# Altium project STM32G4_DRV8301_hardware.PrjPcb (part 3 of 5)

## Sheet DRV8301_inverter.SchDoc
size 594 x 420 mm; SheetNumber: 8; SheetTotal: 9
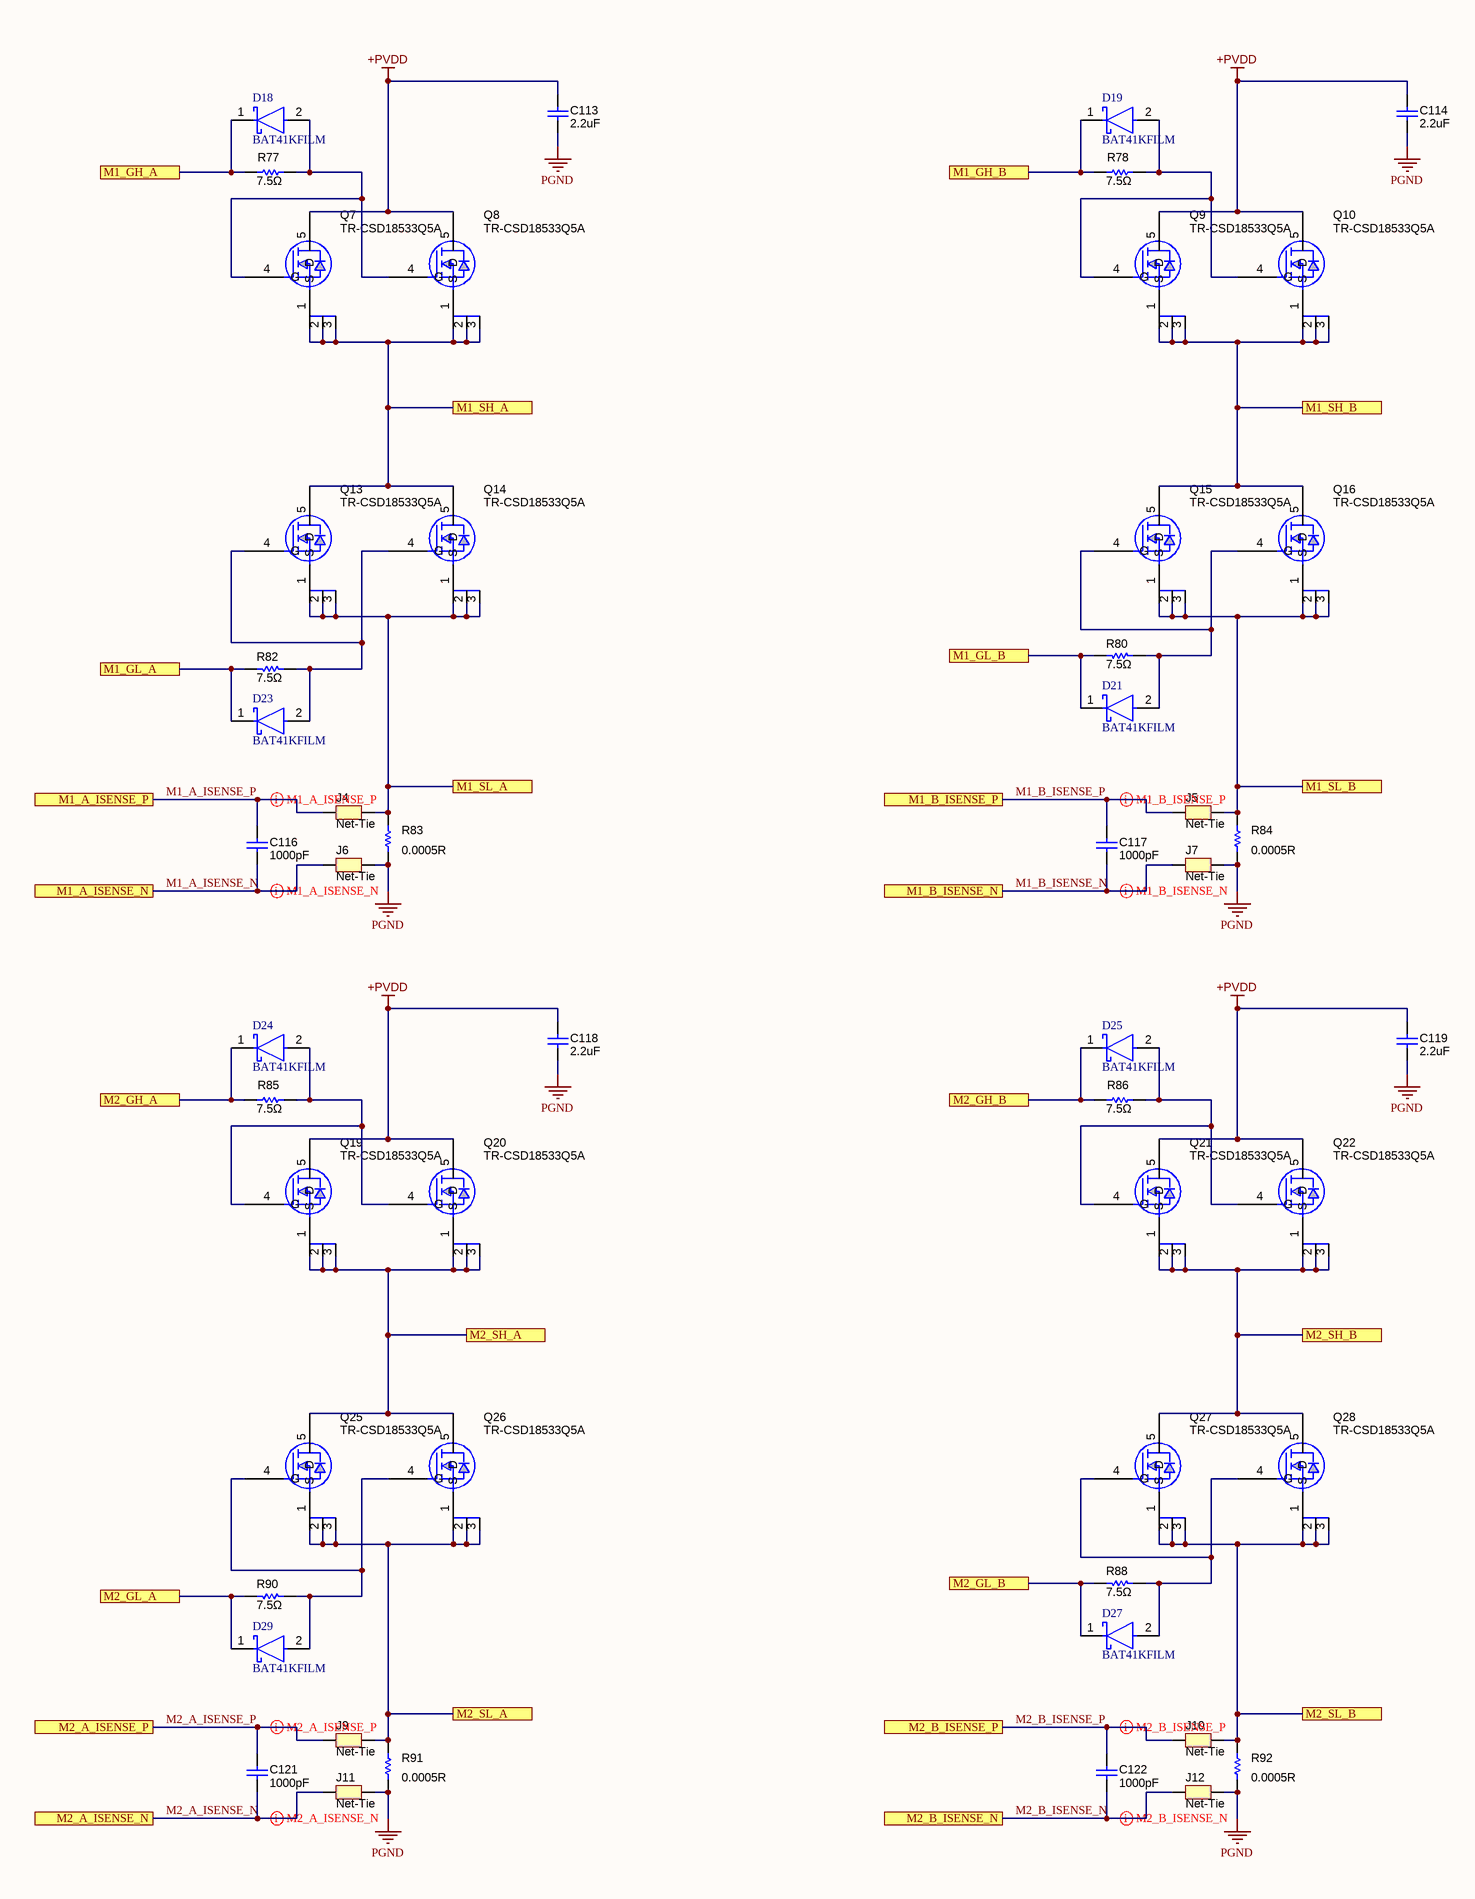
[diagram p6: DRV8301_inverter.SchDoc, left]
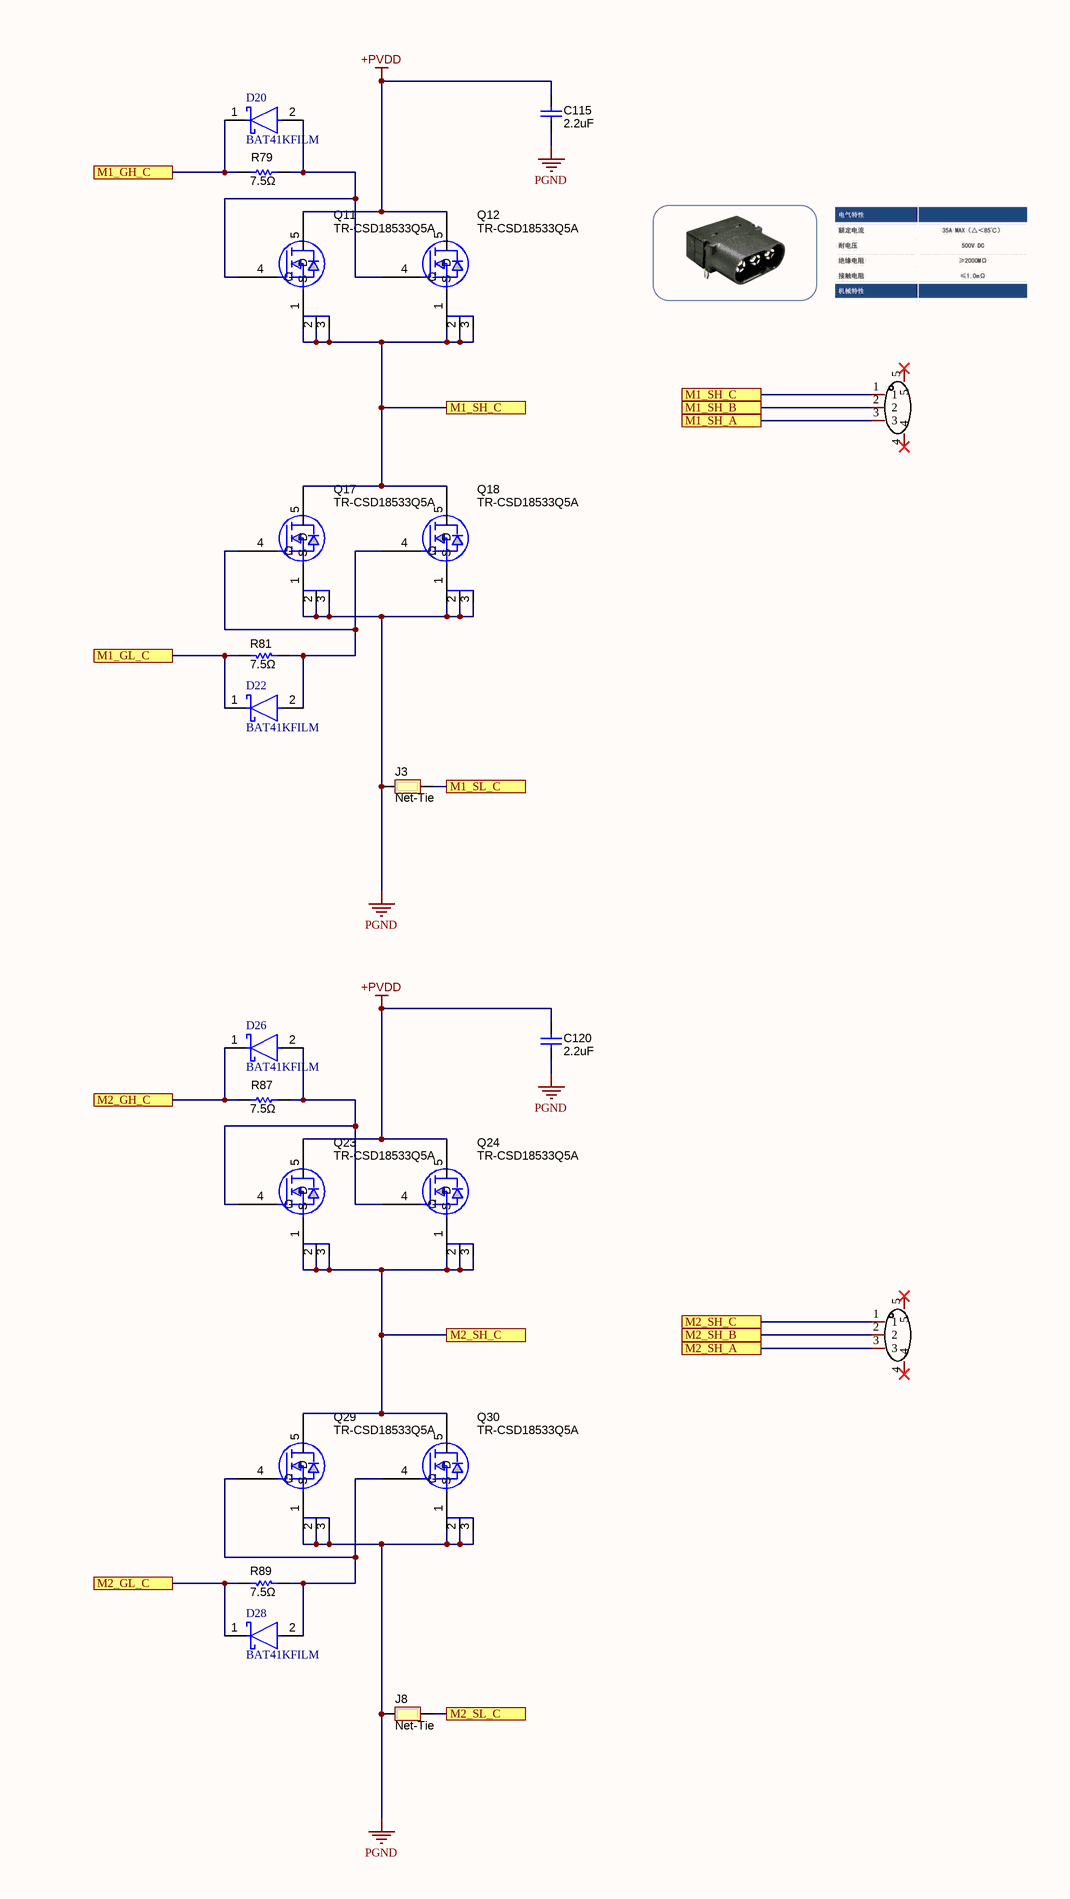
[diagram p7: DRV8301_inverter.SchDoc, right]

### Parts
C113  ValueDisplayed: 2.2uF  [1210L]  (hidden comment: GRM32ER72A225KA35L)
C114  ValueDisplayed: 2.2uF  [1210L]  (hidden comment: GRM32ER72A225KA35L)
C115  ValueDisplayed: 2.2uF  [1210L]  (hidden comment: GRM32ER72A225KA35L)
C116  ValueDisplayed: 1000pF  [0603]  (hidden comment: C0603C102J5GAC)
C117  ValueDisplayed: 1000pF  [0603]  (hidden comment: C0603C102J5GAC)
C118  ValueDisplayed: 2.2uF  [1210L]  (hidden comment: GRM32ER72A225KA35L)
C119  ValueDisplayed: 2.2uF  [1210L]  (hidden comment: GRM32ER72A225KA35L)
C120  ValueDisplayed: 2.2uF  [1210L]  (hidden comment: GRM32ER72A225KA35L)
C121  ValueDisplayed: 1000pF  [0603]  (hidden comment: C0603C102J5GAC)
C122  ValueDisplayed: 1000pF  [0603]  (hidden comment: C0603C102J5GAC)
D18  BAT41KFILM  [FP-SOD-523-MFG]
D19  BAT41KFILM  [FP-SOD-523-MFG]
D20  BAT41KFILM  [FP-SOD-523-MFG]
D21  BAT41KFILM  [FP-SOD-523-MFG]
D22  BAT41KFILM  [FP-SOD-523-MFG]
D23  BAT41KFILM  [FP-SOD-523-MFG]
D24  BAT41KFILM  [FP-SOD-523-MFG]
D25  BAT41KFILM  [FP-SOD-523-MFG]
D26  BAT41KFILM  [FP-SOD-523-MFG]
D27  BAT41KFILM  [FP-SOD-523-MFG]
D28  BAT41KFILM  [FP-SOD-523-MFG]
D29  BAT41KFILM  [FP-SOD-523-MFG]
J3  Net-Tie  [Net-Tie_10mil]  (net tie, no BOM)
J4  Net-Tie  [Net-Tie_10mil]  (net tie, no BOM)
J5  Net-Tie  [Net-Tie_10mil]  (net tie, no BOM)
J6  Net-Tie  [Net-Tie_10mil]  (net tie, no BOM)
J7  Net-Tie  [Net-Tie_10mil]  (net tie, no BOM)
J8  Net-Tie  [Net-Tie_10mil]  (net tie, no BOM)
J9  Net-Tie  [Net-Tie_10mil]  (net tie, no BOM)
J10  Net-Tie  [Net-Tie_10mil]  (net tie, no BOM)
J11  Net-Tie  [Net-Tie_10mil]  (net tie, no BOM)
J12  Net-Tie  [Net-Tie_10mil]  (net tie, no BOM)
Q7  TR-CSD18533Q5A  [QFN5X6MM]
Q8  TR-CSD18533Q5A  [QFN5X6MM]
Q9  TR-CSD18533Q5A  [QFN5X6MM]
Q10  TR-CSD18533Q5A  [QFN5X6MM]
Q11  TR-CSD18533Q5A  [QFN5X6MM]
Q12  TR-CSD18533Q5A  [QFN5X6MM]
Q13  TR-CSD18533Q5A  [QFN5X6MM]
Q14  TR-CSD18533Q5A  [QFN5X6MM]
Q15  TR-CSD18533Q5A  [QFN5X6MM]
Q16  TR-CSD18533Q5A  [QFN5X6MM]
Q17  TR-CSD18533Q5A  [QFN5X6MM]
Q18  TR-CSD18533Q5A  [QFN5X6MM]
Q19  TR-CSD18533Q5A  [QFN5X6MM]
Q20  TR-CSD18533Q5A  [QFN5X6MM]
Q21  TR-CSD18533Q5A  [QFN5X6MM]
Q22  TR-CSD18533Q5A  [QFN5X6MM]
Q23  TR-CSD18533Q5A  [QFN5X6MM]
Q24  TR-CSD18533Q5A  [QFN5X6MM]
Q25  TR-CSD18533Q5A  [QFN5X6MM]
Q26  TR-CSD18533Q5A  [QFN5X6MM]
Q27  TR-CSD18533Q5A  [QFN5X6MM]
Q28  TR-CSD18533Q5A  [QFN5X6MM]
Q29  TR-CSD18533Q5A  [QFN5X6MM]
Q30  TR-CSD18533Q5A  [QFN5X6MM]
R77  value 7.5Ω  [0603L]  (hidden comment: CRCW060310R0JNEA)
R78  value 7.5Ω  [0603L]  (hidden comment: CRCW060310R0JNEA)
R79  value 7.5Ω  [0603L]  (hidden comment: CRCW060310R0JNEA)
R80  value 7.5Ω  [0603L]  (hidden comment: CRCW060310R0JNEA)
R81  value 7.5Ω  [0603L]  (hidden comment: CRCW060310R0JNEA)
R82  value 7.5Ω  [0603L]  (hidden comment: CRCW060310R0JNEA)
R83  value 0.0005R  [2512M]  (hidden comment: CRA2512-FZ-R010ELF)
R84  value 0.0005R  [2512M]  (hidden comment: CRA2512-FZ-R010ELF)
R85  value 7.5Ω  [0603L]  (hidden comment: CRCW060310R0JNEA)
R86  value 7.5Ω  [0603L]  (hidden comment: CRCW060310R0JNEA)
R87  value 7.5Ω  [0603L]  (hidden comment: CRCW060310R0JNEA)
R88  value 7.5Ω  [0603L]  (hidden comment: CRCW060310R0JNEA)
R89  value 7.5Ω  [0603L]  (hidden comment: CRCW060310R0JNEA)
R90  value 7.5Ω  [0603L]  (hidden comment: CRCW060310R0JNEA)
R91  value 0.0005R  [2512M]  (hidden comment: CRA2512-FZ-R010ELF)
R92  value 0.0005R  [2512M]  (hidden comment: CRA2512-FZ-R010ELF)
U25  MR60PW-M.G.B  [CONN-TH_MR60PW]  (value not drawn)
U26  MR60PW-M.G.B  [CONN-TH_MR60PW]  (value not drawn)

### Ports
M1_A_ISENSE_N (see STM32G4_DRV8301_hardware_TOP_V1.0[6D], M1_DRV8301_driver[6D]), M1_A_ISENSE_P (see STM32G4_DRV8301_hardware_TOP_V1.0[6D], M1_DRV8301_driver[6D]), M1_B_ISENSE_N (see STM32G4_DRV8301_hardware_TOP_V1.0[6D], M1_DRV8301_driver[6D]), M1_B_ISENSE_P (see STM32G4_DRV8301_hardware_TOP_V1.0[6D], M1_DRV8301_driver[6D]), M1_GH_A (see STM32G4_DRV8301_hardware_TOP_V1.0[6C], M1_DRV8301_driver[6C]), M1_GH_B (see STM32G4_DRV8301_hardware_TOP_V1.0[6C], M1_DRV8301_driver[6C]), M1_GH_C (see STM32G4_DRV8301_hardware_TOP_V1.0[6C], M1_DRV8301_driver[6D]), M1_GL_A (see STM32G4_DRV8301_hardware_TOP_V1.0[6C], M1_DRV8301_driver[6C]), M1_GL_B (see STM32G4_DRV8301_hardware_TOP_V1.0[6C], M1_DRV8301_driver[6C]), M1_GL_C (see STM32G4_DRV8301_hardware_TOP_V1.0[6D], M1_DRV8301_driver[6D]), M1_SH_A (see STM32G4_DRV8301_hardware_TOP_V1.0[6C], M1_DRV8301_driver[7C]), M1_SH_B (see STM32G4_DRV8301_hardware_TOP_V1.0[6C], M1_DRV8301_driver[7C]), M1_SH_C (see STM32G4_DRV8301_hardware_TOP_V1.0[6D], M1_DRV8301_driver[7D]), M1_SL_A (see STM32G4_DRV8301_hardware_TOP_V1.0[6C], M1_DRV8301_driver[6C]), M1_SL_B (see STM32G4_DRV8301_hardware_TOP_V1.0[6C], M1_DRV8301_driver[6C]), M1_SL_C (see STM32G4_DRV8301_hardware_TOP_V1.0[6D], M1_DRV8301_driver[6D]), M2_A_ISENSE_N (see STM32G4_DRV8301_hardware_TOP_V1.0[6C], M2_DRV8301_driver[7D]), M2_A_ISENSE_P (see STM32G4_DRV8301_hardware_TOP_V1.0[6C], M2_DRV8301_driver[7D]), M2_B_ISENSE_N (see STM32G4_DRV8301_hardware_TOP_V1.0[6C], M2_DRV8301_driver[7D]), M2_B_ISENSE_P (see STM32G4_DRV8301_hardware_TOP_V1.0[6C], M2_DRV8301_driver[7D]), M2_GH_A (see STM32G4_DRV8301_hardware_TOP_V1.0[6B], M2_DRV8301_driver[6C]), M2_GH_B (see STM32G4_DRV8301_hardware_TOP_V1.0[6B], M2_DRV8301_driver[6C]), M2_GH_C (see STM32G4_DRV8301_hardware_TOP_V1.0[6C], M2_DRV8301_driver[6D]), M2_GL_A (see STM32G4_DRV8301_hardware_TOP_V1.0[6B], M2_DRV8301_driver[6C]), M2_GL_B (see STM32G4_DRV8301_hardware_TOP_V1.0[6B], M2_DRV8301_driver[6C]), M2_GL_C (see STM32G4_DRV8301_hardware_TOP_V1.0[6C], M2_DRV8301_driver[6D]), M2_SH_A (see STM32G4_DRV8301_hardware_TOP_V1.0[6B], M2_DRV8301_driver[7C]), M2_SH_B (see STM32G4_DRV8301_hardware_TOP_V1.0[6B], M2_DRV8301_driver[7C]), M2_SH_C (see STM32G4_DRV8301_hardware_TOP_V1.0[6C], M2_DRV8301_driver[7D]), M2_SL_A (see STM32G4_DRV8301_hardware_TOP_V1.0[6B], M2_DRV8301_driver[6C]), M2_SL_B (see STM32G4_DRV8301_hardware_TOP_V1.0[6B], M2_DRV8301_driver[6C]), M2_SL_C (see STM32G4_DRV8301_hardware_TOP_V1.0[6C], M2_DRV8301_driver[6D])

### Nets
+PVDD: C113.1 C114.1 C115.1 C118.1 C119.1 C120.1 Q7.5(D) Q8.5(D) Q9.5(D) Q10.5(D) Q11.5(D) Q12.5(D) Q19.5(D) Q20.5(D) Q21.5(D) Q22.5(D) Q23.5(D) Q24.5(D)
PGND: C113.2 C114.2 C115.2 C118.2 C119.2 C120.2 J3.2 J6.1 J7.1 J8.2 J11.1 J12.1 Q17.1(S) Q17.2 Q17.3 Q18.1(S) Q18.2 Q18.3 Q29.1(S) Q29.2 Q29.3 Q30.1(S) Q30.2 Q30.3 R83.1 R84.1 R91.1 R92.1
M1_A_ISENSE_N: C116.2 J6.2 ; port M1_A_ISENSE_N
M1_A_ISENSE_P: C116.1 J4.2 ; port M1_A_ISENSE_P
M1_B_ISENSE_N: C117.2 J7.2 ; port M1_B_ISENSE_N
M1_B_ISENSE_P: C117.1 J5.2 ; port M1_B_ISENSE_P
M1_GH_A: D18.1(C) R77.1 ; port M1_GH_A
M1_GH_B: D19.1(C) R78.1 ; port M1_GH_B
M1_GH_C: D20.1(C) R79.1 ; port M1_GH_C
M1_GL_A: D23.1(C) R82.1 ; port M1_GL_A
M1_GL_B: D21.1(C) R80.1 ; port M1_GL_B
M1_GL_C: D22.1(C) R81.1 ; port M1_GL_C
M1_SH_A: Q7.1(S) Q7.2 Q7.3 Q8.1(S) Q8.2 Q8.3 Q13.5(D) Q14.5(D) U25.3 ; port M1_SH_A
M1_SH_B: Q9.1(S) Q9.2 Q9.3 Q10.1(S) Q10.2 Q10.3 Q15.5(D) Q16.5(D) U25.2 ; port M1_SH_B
M1_SH_C: Q11.1(S) Q11.2 Q11.3 Q12.1(S) Q12.2 Q12.3 Q17.5(D) Q18.5(D) U25.1 ; port M1_SH_C
M1_SL_A: J4.1 Q13.1(S) Q13.2 Q13.3 Q14.1(S) Q14.2 Q14.3 R83.2 ; port M1_SL_A
M1_SL_B: J5.1 Q15.1(S) Q15.2 Q15.3 Q16.1(S) Q16.2 Q16.3 R84.2 ; port M1_SL_B
M1_SL_C: J3.1 ; port M1_SL_C
M2_A_ISENSE_N: C121.2 J11.2 ; port M2_A_ISENSE_N
M2_A_ISENSE_P: C121.1 J9.2 ; port M2_A_ISENSE_P
M2_B_ISENSE_N: C122.2 J12.2 ; port M2_B_ISENSE_N
M2_B_ISENSE_P: C122.1 J10.2 ; port M2_B_ISENSE_P
M2_GH_A: D24.1(C) R85.1 ; port M2_GH_A
M2_GH_B: D25.1(C) R86.1 ; port M2_GH_B
M2_GH_C: D26.1(C) R87.1 ; port M2_GH_C
M2_GL_A: D29.1(C) R90.1 ; port M2_GL_A
M2_GL_B: D27.1(C) R88.1 ; port M2_GL_B
M2_GL_C: D28.1(C) R89.1 ; port M2_GL_C
M2_SH_A: Q19.1(S) Q19.2 Q19.3 Q20.1(S) Q20.2 Q20.3 Q25.5(D) Q26.5(D) U26.3 ; port M2_SH_A
M2_SH_B: Q21.1(S) Q21.2 Q21.3 Q22.1(S) Q22.2 Q22.3 Q27.5(D) Q28.5(D) U26.2 ; port M2_SH_B
M2_SH_C: Q23.1(S) Q23.2 Q23.3 Q24.1(S) Q24.2 Q24.3 Q29.5(D) Q30.5(D) U26.1 ; port M2_SH_C
M2_SL_A: J9.1 Q25.1(S) Q25.2 Q25.3 Q26.1(S) Q26.2 Q26.3 R91.2 ; port M2_SL_A
M2_SL_B: J10.1 Q27.1(S) Q27.2 Q27.3 Q28.1(S) Q28.2 Q28.3 R92.2 ; port M2_SL_B
M2_SL_C: J8.1 ; port M2_SL_C
NetD18_2: D18.2(A) Q7.4(G) Q8.4(G) R77.2
NetD19_2: D19.2(A) Q9.4(G) Q10.4(G) R78.2
NetD20_2: D20.2(A) Q11.4(G) Q12.4(G) R79.2
NetD21_2: D21.2(A) Q15.4(G) Q16.4(G) R80.2
NetD22_2: D22.2(A) Q17.4(G) Q18.4(G) R81.2
NetD23_2: D23.2(A) Q13.4(G) Q14.4(G) R82.2
NetD24_2: D24.2(A) Q19.4(G) Q20.4(G) R85.2
NetD25_2: D25.2(A) Q21.4(G) Q22.4(G) R86.2
NetD26_2: D26.2(A) Q23.4(G) Q24.4(G) R87.2
NetD27_2: D27.2(A) Q27.4(G) Q28.4(G) R88.2
NetD28_2: D28.2(A) Q29.4(G) Q30.4(G) R89.2
NetD29_2: D29.2(A) Q25.4(G) Q26.4(G) R90.2

Not connected (* = marked no-connect by the designer): U25 4* 5*; U26 4* 5*

### Layout directives
differential pair: M1_A_ISENSE_N, M1_A_ISENSE_P, M1_B_ISENSE_N, M1_B_ISENSE_P, M2_A_ISENSE_N, M2_A_ISENSE_P, M2_B_ISENSE_N, M2_B_ISENSE_P

### Notes on the sheet
- DWG NO:
- REV:
- THIS DOCUMENT AND THE DATA DISCLOSED HEREIN OR
- HEREWITH IS THE PROPERTY OF ALTIUM LIMITED AND MAY
- BE FREELY DISTRIBUTED IN WHOLE. NO RIGHTS ARE
- RESERVED OR EXPRESS OR IMPLIED WARANTEE GIVEN.
- REVISION
- DESCRIPTION
- DATE
- APPROVED
- ENG:
- APPROVALS
- PROJECT
- DSN:
- CHK:
- REFERENCE DOCUMENTS
- PROJECT REVISION:
- TITLE
- DOCUMENT REVISION:
- DESIGN ITEM:
- BOM:
- FAB DWG:
- PCB DWG:
- ASSY DWG:
- SCALE:
- A2
- SIZE
- CAGE CODE
- FILE NAME
- DWG NO.
- SHEET
- OF
- REV

### Library data of the parts
C113-C115 C118-C120 = GRM32ER72A225KA35L: CAP, CERM, 2.2uF, 100V, +/-10%, X7R, 1210; Manufacturer: MuRata; Polarized: N; CompType: Capacitor; U/M: EA; Cap_F: 0.0000022; Tolerance_%: 10; ESR_Ohm: 0.007; Value1: 0.007 ohm; VDC_V: 100; IRMS_A: 4.4; TaMin_C: -55; TaMax_C: 125; Cap_Case: 1210; SymbolVersion: 2008-07-09; Value: 2.2uF; PartNumber: GRM32ER72A225KA35L; PackageReference: 1210; RoHS: Y; Value2: 100V; MountType: SMT; Technology: Ceramic; TempCo: X7R; Published: 2008-06-19; Publisher: Texas Instruments; LatestRevisionDate: 2013-05-24; LatestRevisionNote: Changed publisher; ComponentLink1Description: Datasheet link; ComponentLink1URL: http://search.murata.co.jp/Ceramy/PnsearchViewAction.do?HnOFG=ON&HnNFG=ON&SEL_CNT=50&sLang=en&sKey=GRM32ER72A225KA35L&x=9&y=9&search=startwith; Supplier 1: Digi-Key; Supplier Part Number 1: 490-3385-1-ND; Supplier 2: Mouser; Supplier Part Number 2: 81-GRM32ER72A225KA35; Supplier 3: Farnell; Supplier Part Number 3: 1735547
C116 C117 C121 C122 = C0603C102J5GAC: CAP, CERM, 1000pF, 50V, +/-5%, C0G/NP0, 0603; Manufacturer: Kemet; Polarized: N; CompType: Capacitor; U/M: EA; Cap_F: 0.000000001; Tolerance_%: 5; Value1: Unknown; VDC_V: 50; TaMin_C: -55; TaMax_C: 125; SymbolVersion: 2008-07-09; Value: 1000pF; PartNumber: C0603C102J5GAC; PackageReference: 0603; RoHS: Y; Value2: 50V; MountType: SMT; Technology: Ceramic; TempCo: C0G/NP0; Cap_Case: 0603; Published: 2008-06-19; Publisher: Texas Instruments; LatestRevisionDate: 2013-05-24; LatestRevisionNote: Changed publisher; ComponentLink1Description: Datasheet link; ComponentLink1URL: http://www.kemet.com/kemet/web/homepage/kechome.nsf/vapubfiles/F3102_Y5V.pdf/$file/F3102_Y5V.pdf; Supplier 1: Farnell; Supplier Part Number 1: 317202
D18-D29 = CMP-12187-000015-1: DIODE SCHOTTKY 100V 200MA SOD523; Manufacturer: STMicroelectronics; Max Junction Temp: +150°C; Max Surge Forward Current: 1A; Capacitance: 3pF; Peak Reverse Current: 0.1uA; Value: 3pF; Automotive: No; Max Repetitive Reverse Voltage: 100V; Octopart: https://octopart.com/bat41kfilm-stmicroelectronics-658186; Temperature Range High: +150°C; Digikey Description: DIODE SCHOTTKY 100V 200MA SOD523; Device Class L2: Diodes; Forward Current: 200mA; Device Class L1: Discrete Semiconductors; Lead Free: Yes; Temperature: to +150°C; Manufacturer Part Number: BAT41KFILM; Mouser Description: Schottky Diodes & Rectifiers schottky diode; Height: 0.7mm; RoHS: TRUE; ComponentLink2Description: Datasheet; Device Class L3: Schottky Diodes; Category: Diode; Package: SOD-523; ComponentLink2URL: https://www.st.com/resource/en/datasheet/bat41.pdf
J3-J12 = Net-Tie: Single point connection between nets.; SymbolCreator: codlsc; SymbolVersion: 2009-07-01; MountType: SMT; Publisher: Texas Instruments; LatestRevisionDate: 2013-05-15; LatestRevisionNote: Added Alternate PartNumber and Alternate Manufacturer parameters to appropriate components.
Q7-Q30 = TR-CSD18533Q5A: MOSFET, N-Chan, 60V, 18A, 6.1 mOhm; Manufacturer: TI; Area: 86800; SymbolVersion: 04/25/2012 11:24:36; PartNumber: CSD18533Q5A; ComponentLink1URL: \\vette02\pmp_pcb\pcad_pdf's\CSD18533Q5A.pdf; PackageReference: QFN-8 POWER; Value: CSD18533Q5A; ComponentHeight: *; ComponentLink1Description: AEO Datasheet Link
R77-R82 R85-R90 = CRCW060310R0JNEA: RES, 7.5 ohm, 5%, 0.1W, 0603; Manufacturer: Vishay-Dale; CompType: Resistor; Res_ohm: 10; Value_Code: 10R0; Tolerance_%: 5; Power_W: 0.1; VDC_V: 75; TempCo: 200 ppm/C; EIA_Code: E24; U/M: EA; SymbolVersion: 2009-05-29; PartNumber: CRCW060310R0JNEA; PackageReference: 0603; RoHS: Y; Value1: 5%; Value2: 0.1W; MountType: SMT; Technology: Thick Film; Published: 2008-06-26; Publisher: Texas Instruments; LatestRevisionDate: 2013-01-08; ComponentLink1Description: Datasheet link; ComponentLink1URL: http://www.vishay.com/docs/20035/dcrcwe3.pdf; Supplier 1: Digi-Key; Supplier Part Number 1: 541-10GCT-ND; Supplier 2: Mouser; Supplier Part Number 2: 71-CRCW0603J-10-E3; Supplier 3: Farnell; Supplier Part Number 3: 1514712
R83 R84 R91 R92 = CRA2512-FZ-R010ELF: RES, 0.01 ohm, 1%, 3W, 2512; Manufacturer: Bourns; CompType: Resistor; Res_ohm: 0.01; Value_Code: R010; Tolerance_%: 1; Power_W: 3; TempCo: 75 ppm/C; EIA_Code: E96; U/M: EA; SymbolVersion: 2009-05-29; PartNumber: CRA2512-FZ-R010ELF; PackageReference: 2512; RoHS: Y; Value1: 1%; Value2: 3W; MountType: SMT; Technology: Metal Film; Published: 2008-06-26; Publisher: Texas Instruments; LatestRevisionDate: 2013-05-25; ComponentLink1Description: Datasheet link; ComponentLink1URL: http://www.bourns.com/data/global/pdfs/CRA.pdf; Supplier 1: Digi-Key; Supplier Part Number 1: CRA2512-FZ-R010ELFCT-ND; Supplier 2: Mouser; Supplier Part Number 2: 652-CRA2512FZR010ELF; Supplier 3: Farnell; Supplier Part Number 3: 1435947
U25 U26 = MR60PW-M.G.B: Manufacturer: AMASS(艾迈斯); Add into BOM: yes; Symbol: MR60PW-M.G.B; Device: MR60PW-M.G.B; LCSC Part Name: MR60PW 20A三芯PCB弯插公镀金黑色; Supplier Part: C19268044; Manufacturer Part: MR60PW-M.G.B; Supplier Footprint: -; JLCPCB Part Class: Extended Part; Datasheet: https://atta.szlcsc.com/upload/public/pdf/source/20231221/53B4DC893AF29571B873350396E957CB.pdf; Supplier: LCSC; Convert to PCB: yes

## Sheet STM32F1_microcontroller.SchDoc
size 420 x 297 mm; SheetNumber: 9; SheetTotal: 9
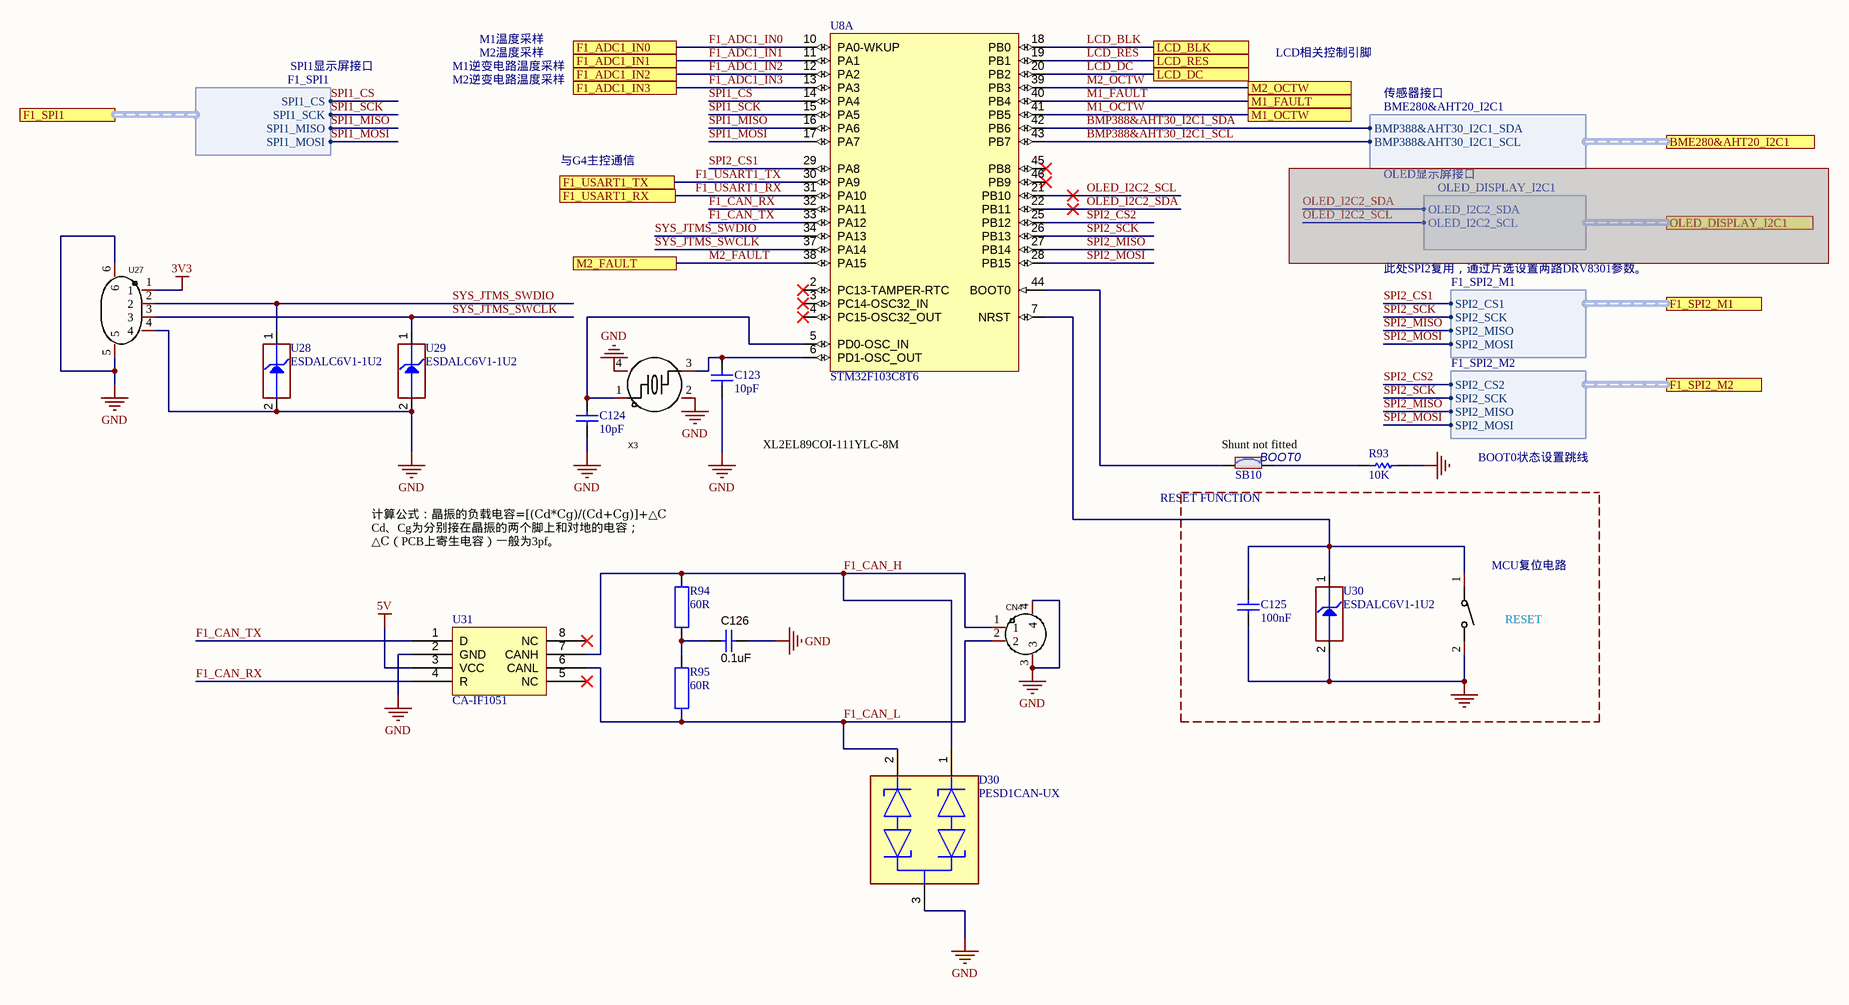
[diagram p8: STM32F1_microcontroller.SchDoc]

### Parts
C123  value 10pF  [C0402]
C124  value 10pF  [C0402]
C125  value 100nF  [C0402]
C126  ValueDisplayed: 0.1uF  [0603L]  (hidden comment: GRM188R61E105KA12D)
CN4  WAFER-GH1.25-2PWB  [CONN-TH_2P-P1.25_XUNPU_WAFER-GH1.25-2PWB]  (value not drawn)
D30  PESD1CAN-UX  [FP-SOT323-MFG]
R93  value 10K  [R0603]
R94  60R  [RESC1608X55N]
R95  60R  [RESC1608X55N]
SB10  MCD-00071  [SOLDER-BRIDGE_R0603-0R]  (value not drawn)
SW2  TS-1088-AR02016  [SW-SMD_L3.9-W3.0-P4.45]  (value not drawn)
U8  STM32F103C8T6  [STM-LQFP48_L]  (part A of 2)
U27  WAFER-GH1.25-4PWB  [CONN-SMD_4P-P1.25_XUNPU_WAFER-GH1.25-4PWB]  (value not drawn)
U28  value ESDALC6V1-1U2  [ESD_ST0201]
U29  value ESDALC6V1-1U2  [ESD_ST0201]
U30  value ESDALC6V1-1U2  [ESD_ST0201]
U31  CA-IF1051  [SOIC127P600X175-8N]
X3  8MHz  [CRYSTAL-SMD_4P-L3.2-W2.5-BL-1]  (value not drawn)

### Ports
BME280&AHT20_I2C1 (harness BME280&AHT20_I2C1, see STM32G4_DRV8301_hardware_TOP_V1.0[3B], DRV8301_SENSE[3D]), F1_ADC1_IN0 (see STM32G4_DRV8301_hardware_TOP_V1.0[2B]), F1_ADC1_IN1 (see STM32G4_DRV8301_hardware_TOP_V1.0[2B]), F1_ADC1_IN2 (see STM32G4_DRV8301_hardware_TOP_V1.0[2B]), F1_ADC1_IN3 (see STM32G4_DRV8301_hardware_TOP_V1.0[2B]), F1_SPI1 (harness F1_SPI1, see STM32G4_DRV8301_hardware_TOP_V1.0[3B], DRV8301_SENSE[4D]), F1_SPI2_M1 (harness F1_SPI2_M1, see STM32G4_DRV8301_hardware_TOP_V1.0[3B], M1_DRV8301_driver[3C]), F1_SPI2_M2 (harness F1_SPI2_M2, see STM32G4_DRV8301_hardware_TOP_V1.0[3B], M2_DRV8301_driver[3C]), F1_USART1_RX (see STM32G4_DRV8301_hardware_TOP_V1.0[2B]), F1_USART1_TX (see STM32G4_DRV8301_hardware_TOP_V1.0[2B]), LCD_BLK (see STM32G4_DRV8301_hardware_TOP_V1.0[3B]), LCD_DC (see STM32G4_DRV8301_hardware_TOP_V1.0[3B]), LCD_RES (see STM32G4_DRV8301_hardware_TOP_V1.0[3B]), M1_FAULT (see STM32G4_DRV8301_hardware_TOP_V1.0[2B]), M1_OCTW (see STM32G4_DRV8301_hardware_TOP_V1.0[2B]), M2_FAULT (see STM32G4_DRV8301_hardware_TOP_V1.0[2B]), M2_OCTW (see STM32G4_DRV8301_hardware_TOP_V1.0[2B]), OLED_DISPLAY_I2C1 (harness OLED_DISPLAY_I2C1, see STM32G4_DRV8301_hardware_TOP_V1.0[3B])

### Harnesses
F1_SPI1: SPI1_CS, SPI1_SCK, SPI1_MISO, SPI1_MOSI
BME280&AHT20_I2C1: BMP388&AHT30_I2C1_SDA, BMP388&AHT30_I2C1_SCL
OLED_DISPLAY_I2C1: OLED_I2C2_SDA, OLED_I2C2_SCL
F1_SPI2_M1: SPI2_CS1, SPI2_SCK, SPI2_MISO, SPI2_MOSI
F1_SPI2_M2: SPI2_SCK, SPI2_MISO, SPI2_MOSI, SPI2_CS2

### Nets
3V3: U27.1
5V: U31.3(VCC)
GND: C123.2 C124.2 C125.1 C126.2 CN4.3 CN4.4 D30.3(common_cathode) R93.1 SW2.2 U27.4 U27.5 U27.6 U28.2(GND) U29.2(GND) U30.2(GND) U31.2(GND) X3.2(GND) X3.4(GND)
BMP388&AHT30_I2C1_SCL: U8.43(PB7) ; port BME280&AHT20_I2C1.BMP388&AHT30_I2C1_SCL
BMP388&AHT30_I2C1_SDA: U8.42(PB6) ; port BME280&AHT20_I2C1.BMP388&AHT30_I2C1_SDA
F1_ADC1_IN0: U8.10(PA0-WKUP) ; port F1_ADC1_IN0
F1_ADC1_IN1: U8.11(PA1) ; port F1_ADC1_IN1
F1_ADC1_IN2: U8.12(PA2) ; port F1_ADC1_IN2
F1_ADC1_IN3: U8.13(PA3) ; port F1_ADC1_IN3
F1_CAN_H: CN4.1 D30.1(cathode_1) R94.2 U31.7(CANH)
F1_CAN_L: CN4.2 D30.2(cathode_2) R95.1 U31.6(CANL)
F1_CAN_RX: U8.32(PA11) U31.4(R)
F1_CAN_TX: U8.33(PA12) U31.1(D)
F1_USART1_RX: U8.31(PA10) ; port F1_USART1_RX
F1_USART1_TX: U8.30(PA9) ; port F1_USART1_TX
LCD_BLK: U8.18(PB0) ; port LCD_BLK
LCD_DC: U8.20(PB2) ; port LCD_DC
LCD_RES: U8.19(PB1) ; port LCD_RES
M1_FAULT: U8.40(PB4) ; port M1_FAULT
M1_OCTW: U8.41(PB5) ; port M1_OCTW
M2_FAULT: U8.38(PA15) ; port M2_FAULT
M2_OCTW: U8.39(PB3) ; port M2_OCTW
OLED_I2C2_SCL: U8.21(PB10)
OLED_I2C2_SDA: U8.22(PB11)
SPI1_CS: U8.14(PA4) ; port F1_SPI1.SPI1_CS
SPI1_MISO: U8.16(PA6) ; port F1_SPI1.SPI1_MISO
SPI1_MOSI: U8.17(PA7) ; port F1_SPI1.SPI1_MOSI
SPI1_SCK: U8.15(PA5) ; port F1_SPI1.SPI1_SCK
SPI2_CS1: U8.29(PA8) ; port F1_SPI2_M1.SPI2_CS1  [project net M1_M_PWM/~{SCS}]
SPI2_CS2: U8.25(PB12) ; port F1_SPI2_M2.SPI2_CS2  [project net M2_M_PWM/~{SCS}]
SPI2_MISO: U8.27(PB14) ; port F1_SPI2_M1.SPI2_MISO, port F1_SPI2_M2.SPI2_MISO  [project net M1_GAIN/~{SDO}]
SPI2_MOSI: U8.28(PB15) ; port F1_SPI2_M1.SPI2_MOSI, port F1_SPI2_M2.SPI2_MOSI  [project net M1_M_OC/~{SDI}]
SPI2_SCK: U8.26(PB13) ; port F1_SPI2_M1.SPI2_SCK, port F1_SPI2_M2.SPI2_SCK  [project net M1_OC_ADJ/~{SCLK}]
SYS_JTMS_SWCLK: U8.37(PA14) U27.3 U29.1(IO1)
SYS_JTMS_SWDIO: U8.34(PA13) U27.2 U28.1(IO1)
NetC123_1: C123.1 U8.6(PD1-OSC_OUT) X3.3
NetC124_1: C124.1 U8.5(PD0-OSC_IN) X3.1
NetC125_2: C125.2 SW2.1 U8.7(NRST) U30.1(IO1)
NetC126_1: C126.1 R94.1 R95.2
NetR93_2: R93.2 SB10.2
NetSB10_1: SB10.1 U8.44(BOOT0)

Not connected (* = marked no-connect by the designer): U8 2(PC13-TAMPER-RTC)* 3(PC14-OSC32_IN)* 4(PC15-OSC32_OUT)* 45(PB8)* 46(PB9)*; U31 5(NC)* 8(NC)*

### Notes on the sheet
- SPI1显示屏接口
- M1逆变电路温度采样
- M2逆变电路温度采样
- M1温度采样
- M2温度采样
- LCD相关控制引脚
- 传感器接口
- 与G4主控通信
- OLED显示屏接口
- 此处SPI2复用，通过片选设置两路DRV8301参数。
- XL2EL89COI-111YLC-8M
- (near SB10) Shunt not fitted
- BOOT0
- BOOT0状态设置跳线
- (near R94) 计算公式：晶振的负载电容=[(Cd*Cg)/(Cd+Cg)]+△C
  Cd、Cg为分别接在晶振的两个脚上和对地的电容；
  △C（PCB上寄生电容）一般为3pf。
- RESET FUNCTION
- (near SW2) MCU复位电路
- (near SW2) RESET
- THIS DOCUMENT AND THE DATA DISCLOSED HEREIN OR
- HEREWITH IS THE PROPERTY OF ALTIUM LIMITED AND MAY
- DWG NO:
- REVISION
- REV:
- DESCRIPTION
- DATE
- APPROVED
- BE FREELY DISTRIBUTED IN WHOLE. NO RIGHTS ARE
- RESERVED OR EXPRESS OR IMPLIED WARANTEE GIVEN.
- ENG:
- APPROVALS
- PROJECT
- DSN:
- CHK:
- REFERENCE DOCUMENTS
- PROJECT REVISION:
- TITLE
- DOCUMENT REVISION:
- DESIGN ITEM:
- BOM:
- FAB DWG:
- PCB DWG:
- ASSY DWG:
- SCALE:
- A3
- SIZE
- CAGE CODE
- FILE NAME
- DWG NO.
- SHEET
- OF
- REV

### Library data of the parts
C123 C124 = MCD-00003: Capacitor, MLCC, 5.1pF, 50V, NPO, +-0.25pF, 0402, T=0.5mm; Manufacturer_Part_Number: CC0402CRNPO9BN5R1; Manufacturer: YAGEO; ECCN_US: EAR99; ECCN_EU: NEC; Provided_By: SUBCO; Internal_Part_Number: MCD-00003; ComponentLink1Description: Datasheet; Status: Released; Part_Type: Capacitor; Package: C0402; ComponentLink1URL: http://tunmcdsvn.tun.st.com/Component_Datasheet_Library/Trunk/Capacitors/Yageo_Capacitor_NP0_16V-to-50V
C125 = MCD-00102: Capacitor, MLCC, 100nF, 16V, X7R, 10%, 0402, T=0,5mm; Manufacturer_Part_Number: CC0402KRX7R7BB104; Manufacturer: YAGEO; Provided_By: Subcon; Initial_Board_Reference: MB1262; Internal_Part_Number: MCD-00102; Status: Released; Package: C0402; ComponentLink1Description: Yageo_Capacitor_X7R-series.pdf; ECCN_US: n/a; ECCN_EU: n/a; Part_Type: Capacitor; ComponentLink1URL: http://tunmcdsvn.tun.st.com/Component_Datasheet_Library/Trunk/Capacitors/Yageo_Multilayer_Capacitor_X7R_series_100pF_to_22uF
C126 = GRM188R61E105KA12D: CAP, CERM, 0.1uF, 25V, +/-10%, X5R, 0603; Manufacturer: MuRata; Polarized: N; CompType: Capacitor; Value: 1uF; U/M: EA; Cap_F: 0.000001; Tolerance_%: 10; Value1: Unknown; VDC_V: 25; TaMin_C: -55; TaMax_C: 85; Cap_Case: 0603; SymbolVersion: 2008-07-09; PartNumber: GRM188R61E105KA12D; PackageReference: 0603; RoHS: Y; Value2: 25V; MountType: SMT; Technology: Ceramic; TempCo: X5R; Published: 2008-06-19; Publisher: Texas Instruments; LatestRevisionDate: 2013-05-24; LatestRevisionNote: Changed publisher; ComponentLink1Description: Datasheet link; ComponentLink1URL: http://search.murata.co.jp/Ceramy/PnsearchViewAction.do?HnOFG=ON&HnNFG=ON&SEL_CNT=50&sLang=en&sKey=GRM188R61E105KA12D&x=9&y=9&search=startwith; Supplier 1: Digi-Key; Supplier Part Number 1: 490-3897-1-ND; Supplier 2: Mouser; Supplier Part Number 2: 81-GRM188R61E105KA12; Supplier 3: Farnell; Supplier Part Number 3: 1828802
CN4 = WAFER-GH1.25-2PWB: Manufacturer: XUNPU(讯普); Add into BOM: yes; Pins Structure: 1x2P; Pitch: 1.25mm; Reference Series: GH; Number of PINs Per Row: 2; Current Rating (Max): 1A; Symbol: WAFER-GH1.25-2PWB; Device: WAFER-GH1.25-2PWB; LCSC Part Name: 1x2P 间距:1.25mm 卧贴 系列:GH; Supplier Part: C3029377; Manufacturer Part: WAFER-GH1.25-2PWB; Supplier Footprint: SMD,P=1.25mm,卧贴; JLCPCB Part Class: Extended Part; Datasheet: https://atta.szlcsc.com/upload/public/pdf/source/20220527/CB8773BFB0913C3B8ABD62CB38BA101A.pdf; Supplier: LCSC; Convert to PCB: yes; Mounting Style: 卧贴; Number of Pins: 2P; Number of Rows: 1; Operating Temperature Range: -25℃~+85℃
D30 = CMP-14436-000006-1: TVS DIODE 24V 50V SC70-3
R93 = MCD-00220: Resistor,10K,0603,1%,1/10W; Manufacturer_Part_Number: RC0603FR-0710KL; Manufacturer: YAGEO; Provided_By: Subcon; Initial_Board_Reference: MB1319; Internal_Part_Number: MCD-00220; ECCN_US: n/a; ECCN_EU: n/a; ComponentLink1Description: Yageo_Resistor_RC0603-series.pdf; Status: Released; Part_Type: Resistor; Package: R0603; ComponentLink1URL: http://tunmcdsvn.tun.st.com/Component_Datasheet_Library/Trunk/Resistors/Yageo_Resistor_RC0603-series
R94 R95 = RC0603FR-07120RL: RES SMD 60 OHM 1% 1/10W 0603; Manufacturer: Yageo; Resistance (Ohms): 120; Power (Watts): 0.1W, 1/10W; Temperature Coefficient: ±100ppm/°C; Supplier 1: Digi-Key; Supplier Part Number 1: 311-120HRCT-ND; Manufacturer Part Number: RC0603FR-07120RL; RoHS: RoHS Compliant; Category: Resistors; Stock 1: 1545282; Pricing 1: 1=0.1, 10=0.014, 25=0.01, 100=0.0057, 250=0.00436, 500=0.00348, 1000=0.00257, 2500=0.00223 (USD); Packaging: Cut Tape (CT); Tolerance: ±1%; Composition: Thick Film; Features: Moisture Resistant; Operating Temperature: -55°C ~ 155°C; Package / Case: 0603 (1608 Metric); Supplier Device Package: 0603; Size / Dimension: 0.063" L x 0.031" W (1.60mm x 0.80mm); Height: 0.022" (0.55mm); Number of Terminations: 2; ComponentLink1URL: http://www.yageo.com/documents/recent/PYu-RC_Group_51_RoHS_L_04.pdf; ComponentLink1Description: http://www.yageo.com/documents/recent/PYu-RC_Group_51_RoHS_L_04.pdf
SB10 = MCD-00071: Solder Bridge ON; Part_Type: Mechanical; Manufacturer_Part_Number: RC0603JR-070RL; Manufacturer: YAGEO; Provided_By: SUBCO; Internal_Part_Number: MCD-00071; ECCN_US: n/a; ECCN_EU: n/a; Status: Released; Package: SB0603; ComponentLink1Description: Datasheet; ComponentLink1URL: http://tunmcdsvn.tun.st.com/Component_Datasheet_Library/Trunk/Resistors/Yageo_Resistor_RC0603-series
SW2 = TS-1088-AR02016: Manufacturer: XUNPU(讯普); Add into BOM: yes; Circuit: 单刀单掷; Actuator Style: 圆形按钮; Operating Force: 160gf; Switch Length: 4mm; Switch Width: 3mm; Switch Height: 2mm; Strike Gundam: 不带; Contact Current: 50mA; Voltage Rating (DC): 12V; Insulation Resistance: 100MΩ; Actuator/Cap Color: 黑色; Pin Style: SMD接片; Mechanical Life: 10万次; Symbol: TS-1088-AR02016; Device: TS-1088-AR02016; LCSC Part Name: 4*3*2mm 立贴 轻触开关; Supplier Part: C720477; Manufacturer Part: TS-1088-AR02016; Supplier Footprint: SMD; JLCPCB Part Class: Extended Part; Datasheet: https://atta.szlcsc.com/upload/public/pdf/source/20200810/C720475_60D09DD6C54279ADDB2DC25100F1CC11.pdf; Supplier: LCSC; Convert to PCB: yes; Mounting Style: 立贴; Operating Temperature: -30℃~+80℃
U8 = CMP-0237-00215-3: ARM Cortex-M3 32-bit MCU, 64 KB Flash, 20 KB Internal RAM, 37 I/Os, 48-pin LQFP, -40 to 85 degC, Tray; Supply Voltage(Vcc) min (V): 2; Internal RAM Size (kB): 20; FLASH Size (Prog) (kB): 64; A/D Converter: 2x12-bit (10 Channel); I/Os (High Current): 37; Operating Frequency(F) (Processor speed) (MHz): 72; Core: ARM Cortex-M3; ComponentLink3Description: Package Specification; Mounting Technology: Surface Mount; PartNumber: STM32F103C8T6; PackageReference: LQFP48; Packing: Tray; ComponentLink3URL: http://www.st.com/st-web-ui/static/active/en/resource/technical/document/datasheet/DM00058181.pdf; DatasheetVersion: Rev. 16; ComponentLink1URL: http://www.st.com/web/en/home.html; PackageVersion: Rev. 6, 06/2013; ComponentLink2URL: http://www.st.com/st-web-ui/static/active/en/resource/technical/document/datasheet/CD00161566.pdf; ComponentLink1Description: Manufacturer URL; ComponentLink2Description: Datasheet; PackageDescription: 48-Pin Low Profile Quad Flat Package, 7 x 7 mm Body, 0.5 mm Pitch
U27 = WAFER-GH1.25-4PWB: Manufacturer: XUNPU(讯普); Add into BOM: yes; Pins Structure: 1x4P; Pitch: 1.25mm; Reference Series: GH; Number of PINs Per Row: 4; Current Rating (Max): 1A; Symbol: WAFER-GH1.25-4PWB; Device: WAFER-GH1.25-4PWB; LCSC Part Name: 1x4P 间距:1.25mm 卧贴 系列:GH; Supplier Part: C3029379; Manufacturer Part: WAFER-GH1.25-4PWB; Supplier Footprint: SMD,P=1.25mm,卧贴; JLCPCB Part Class: Extended Part; Datasheet: https://atta.szlcsc.com/upload/public/pdf/source/20220527/CB8773BFB0913C3B8ABD62CB38BA101A.pdf; Supplier: LCSC; Convert to PCB: yes; Mounting Style: 卧贴; Number of Pins: 4P; Number of Rows: 1; Operating Temperature Range: -25℃~+85℃
U28-U30 = MCD-00170: ESD protection 6V1; Part_Type: Diode; Manufacturer: STMICROELECTRONICS; ECCN_US: EAR99; ECCN_EU: NEC; Provided_By: Subcon; Initial_Board_Reference: MB1274; Internal_Part_Number: MCD-00170; Status: Released; Manufacturer_Part_Number: ESDALC6V1-1U2; ComponentLink1Description: STM_ESD_ESDALC6V1-1U2.pdf; ComponentLink1URL: http://tunmcdsvn.tun.st.com/Component_Datasheet_Library/Trunk/Diodes/STM_ESD_ESDALC6V1-1U2
U31 = SN65HVD232D: Manufacturer: Texas Instruments; Protocol: CAN; Number of Drivers/Receivers: 1/1; Duplex: Half; Data Rate: 1Mbps; Voltage - Supply: 3 V ~ 3.6 V; Supplier 1: Digi-Key; Supplier Part Number 1: 296-26344-2-ND; RoHS: RoHS Compliant; Category: Integrated Circuits (ICs); Stock: 5000; Pricing 1: 2500=0.84375 (USD); Packaging: Tape & Reel (TR); Part Status: Active; Type: Transceiver; Operating Temperature: -40°C ~ 85°C; Mounting Type: Surface Mount; Package / Case: 8-SOIC (0.154", 3.90mm Width); Supplier Device Package: 8-SOIC; ComponentLink1URL: http://www.ti.com/lit/ds/symlink/sn65hvd230.pdf; ComponentLink1Description: http://www.ti.com/lit/ds/symlink/sn65hvd230.pdf; Supplier 2: Digi-Key; Supplier Part Number 2: 296-26344-1-ND; Pricing 2: 1=2.05, 10=1.842, 100=1.4809, 500=1.21668, 1000=1.00811 (USD); Manufacturer Part Number: CA-IF1051
X3 = XL2EL89COI-111YLC-8M: Manufacturer: YXC(扬兴晶振); Add into BOM: yes; Crystal Type: 贴片晶振; Normal temperature Frequency Tolerance: ±10ppm; External load capacitor: 12pF; Frequency Stability(Full temperature range): ±20ppm; Equivalent Series Resistance (ESR): 150Ω; Symbol: XL2EL89COI-111YLC-8M; Device: XL2EL89COI-111YLC-8M; LCSC Part Name: 8MHz ±10ppm 12pF; Supplier Part: C2973805; Manufacturer Part: XL2EL89COI-111YLC-8M; Supplier Footprint: SMD3225-4P; JLCPCB Part Class: Extended Part; Datasheet: https://atta.szlcsc.com/upload/public/pdf/source/20240329/19D5F850207469550BEB00D7DFEDBC7A.pdf; Supplier: LCSC; Convert to PCB: yes; Value: 8MHz; Operating Temperature: -40℃~+85℃